# Altium schematic sheet board.SchDoc
size A4
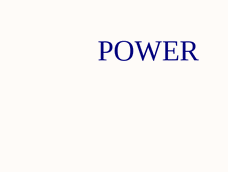
[diagram p0: board.SchDoc, top left]
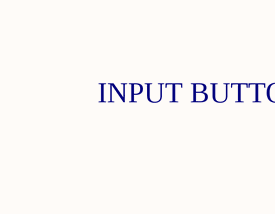
[diagram p1: board.SchDoc, top right]
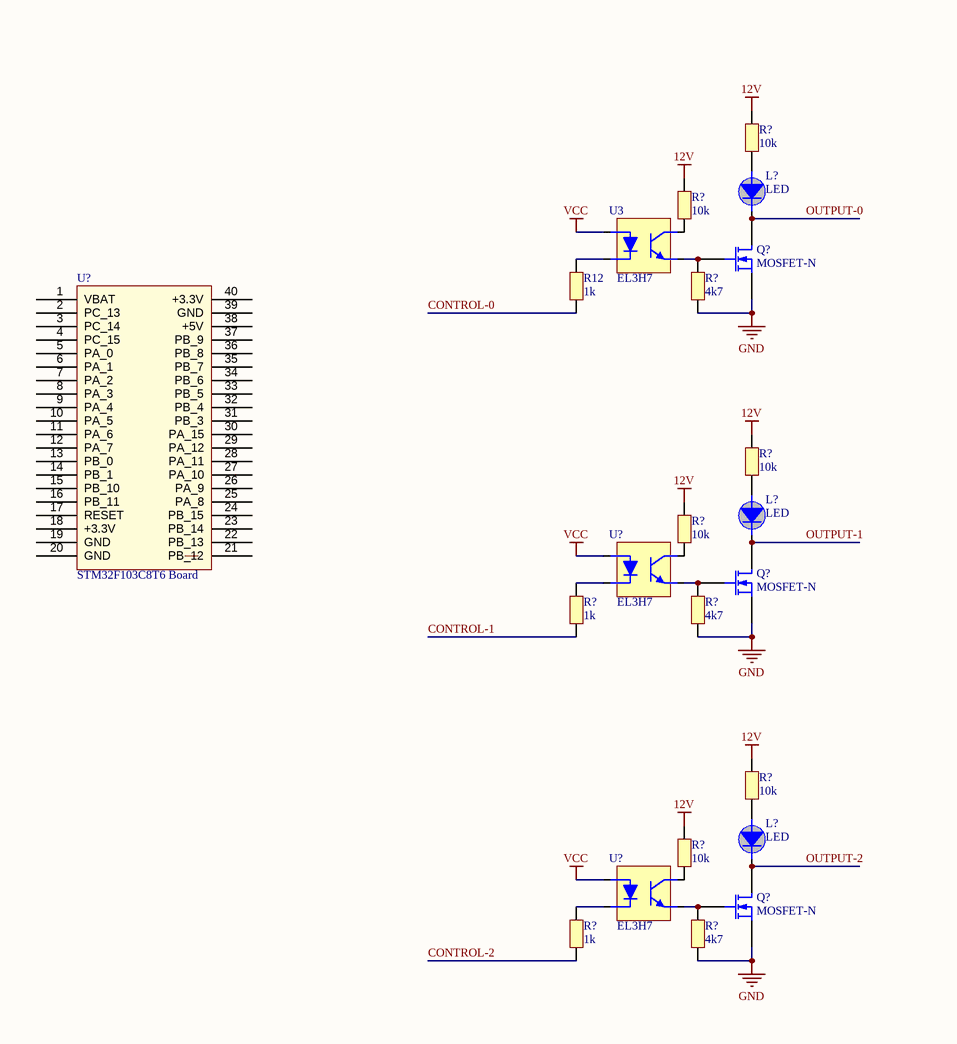
[diagram p2: board.SchDoc, bottom left]

## Parts
(Parts that share a designator on the sheet are numbered #1, #2 ... from top to bottom, then left to right.)
L?#1  LED  [LED 5mm]
L?#2  LED  [LED 5mm]
L?#3  LED  [LED 5mm]
Q?#1  MOSFET-N  [E3]
Q?#2  MOSFET-N  [E3]
Q?#3  MOSFET-N  [E3]
R12  1k  [resistor 0805]
R?#1  10k  [resistor 0805]
R?#2  10k  [resistor 0805]
R?#3  4k7  [resistor 0805]
R?#4  10k  [resistor 0805]
R?#5  10k  [resistor 0805]
R?#6  1k  [resistor 0805]
R?#7  4k7  [resistor 0805]
R?#8  10k  [resistor 0805]
R?#9  10k  [resistor 0805]
R?#10  1k  [resistor 0805]
R?#11  4k7  [resistor 0805]
U3  EL3H7  [SSOP4]
U?#1  STM32F103C8T6 Board  [STM32 Blue Pill]
U?#2  EL3H7  [SSOP4]
U?#3  EL3H7  [SSOP4]

## Nets
12V: R?#1.2 R?#2.2 R?#4.2 R?#5.2 R?#8.2 R?#9.2
GND: Q?#1.3(S) Q?#2.3(S) Q?#3.3(S) R?#3.1 R?#7.1 R?#11.1
VCC: U3.1 U?#2.1 U?#3.1
CONTROL-0: R12.1
CONTROL-1: R?#6.1
CONTROL-2: R?#10.1
OUTPUT-0: L?#1.2(Katot) Q?#1.1(D)
OUTPUT-1: L?#2.2(Katot) Q?#2.1(D)
OUTPUT-2: L?#3.2(Katot) Q?#3.1(D)
NetL?#1_1: L?#1.1(anot) R?#1.1
NetL?#2_1: L?#2.1(anot) R?#4.1
NetL?#3_1: L?#3.1(anot) R?#8.1
NetQ?#1_2: Q?#1.2(G) R?#3.2 U3.3
NetQ?#2_2: Q?#2.2(G) R?#7.2 U?#2.3
NetQ?#3_2: Q?#3.2(G) R?#11.2 U?#3.3
NetR12_2: R12.2 U3.2
NetR?#2_1: R?#2.1 U3.4
NetR?#5_1: R?#5.1 U?#2.4
NetR?#6_2: R?#6.2 U?#2.2
NetR?#9_1: R?#9.1 U?#3.4
NetR?#10_2: R?#10.2 U?#3.2

Not connected (* = marked no-connect by the designer): U?#1 1(VBAT) 2(PC_13) 3(PC_14) 4(PC_15) 5(PA_0) 6(PA_1) 7(PA_2) 8(PA_3) 9(PA_4) 10(PA_5) 11(PA_6) 12(PA_7) 13(PB_0) 14(PB_1) 15(PB_10) 16(PB_11) 17(RESET) 18(+3.3V) 19(GND) 20(GND) 21(PB_12) 22(PB_13) 23(PB_14) 24(PB_15) 25(PA_8) 26(PA_9) 27(PA_10) 28(PA_11) 29(PA_12) 30(PA_15) 31(PB_3) 32(PB_4) 33(PB_5) 34(PB_6) 35(PB_7) 36(PB_8) 37(PB_9) 38(+5V) 39(GND) 40(+3.3V)

## Notes on the sheet
- POWER
- INPUT BUTTON
- DWG. NO.
- REV.
- SHT.
- REVISION
- DESCRIPTION
- DATE
- APPROVED
- THIS DOCUMENT AND THE DATA DISCLOSED HEREIN OR HEREWITH IS THE PROPERTY OF ALTIUM LIMITED AND MAY BE FREELY DISTRIBUTED IN WHOLE. NO RIGHTS ARE RESERVED OR EXPRESS OR IMPLIED WARANTEE GIVEN.
- ENG:
- DSN:
- APPROVALS
- PROJECT
- DOCUMENT REVISION:
- DESIGN ITEM:
- CHK:
- BOM:
- REFERENCE DOCUMENTS
- PROJECT REVISION:
- TITLE
- FAB DWG:
- PCB DWG:
- ASSY DWG:
- SCALE:
- SIZE
- C
- CAGE CODE
- FILE NAME
- DWG NO.
- SHEET
- OF
- REV

## Library data of the parts
L?#1-L?#3 = LED 5mm
Q?#1-Q?#3 = MOSFET-N: N-Channel MOSFET; Published: 8-Jun-2000; LatestRevisionDate: 17-Jul-2002; LatestRevisionNote: Re-released for DXP Platform.; PackageVersion: 1995/1996; PackageReference: E3; Publisher: Altium Limited; PackageDescription: TO, Flat Index; 3 In-Line, Axial Leads; Body Dia. 4.6mm; Lead Dia. 0.5 mm (max)
R12 R?#3 R?#6 R?#7 R?#10 R?#11 = res0805: Value: 10k
R?#1 R?#2 R?#4 R?#5 R?#8 R?#9 = res0805: Value: 10k